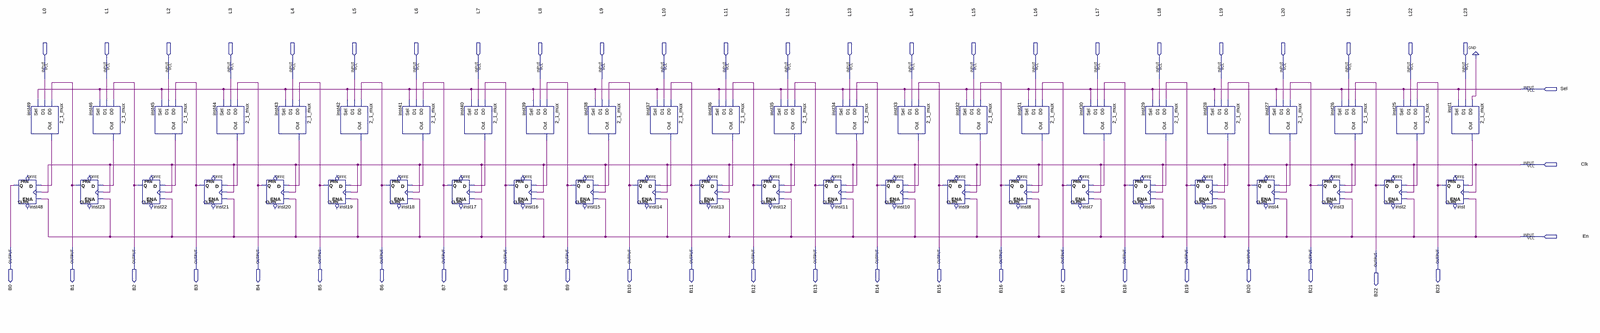
[diagram p0: schematic sheet, whole]
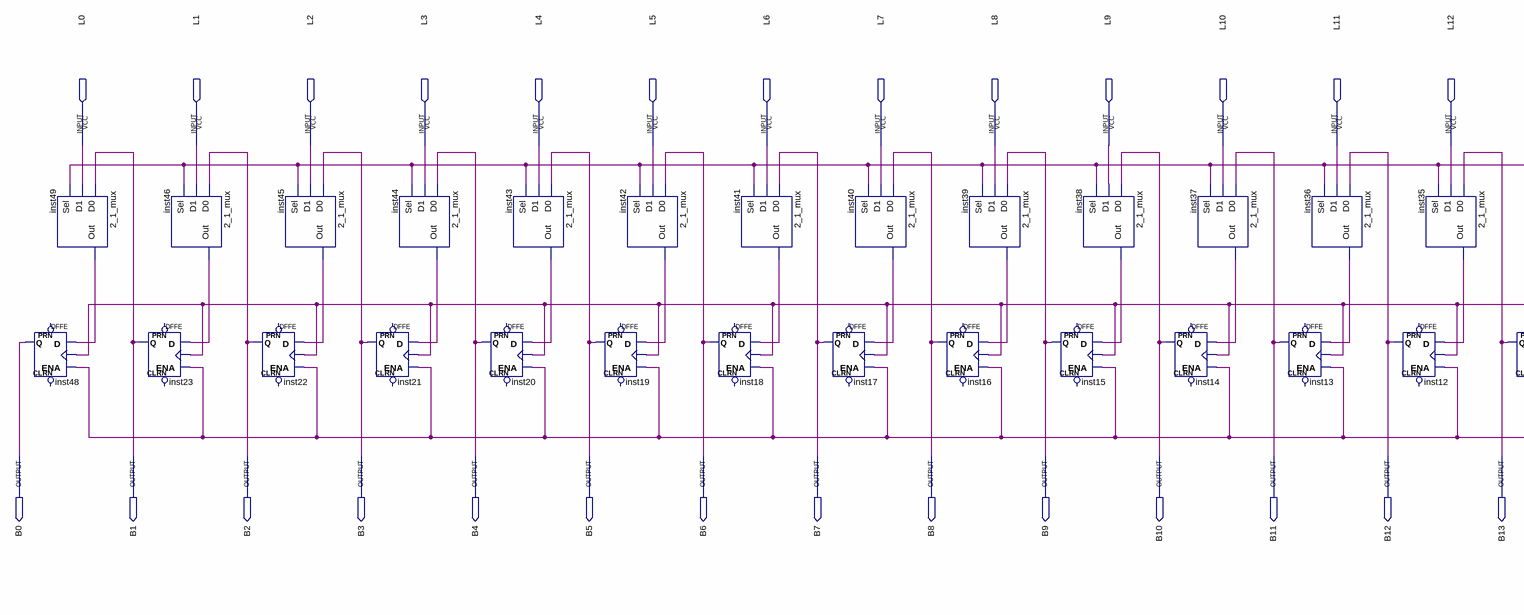
[diagram p1: schematic sheet, left part]
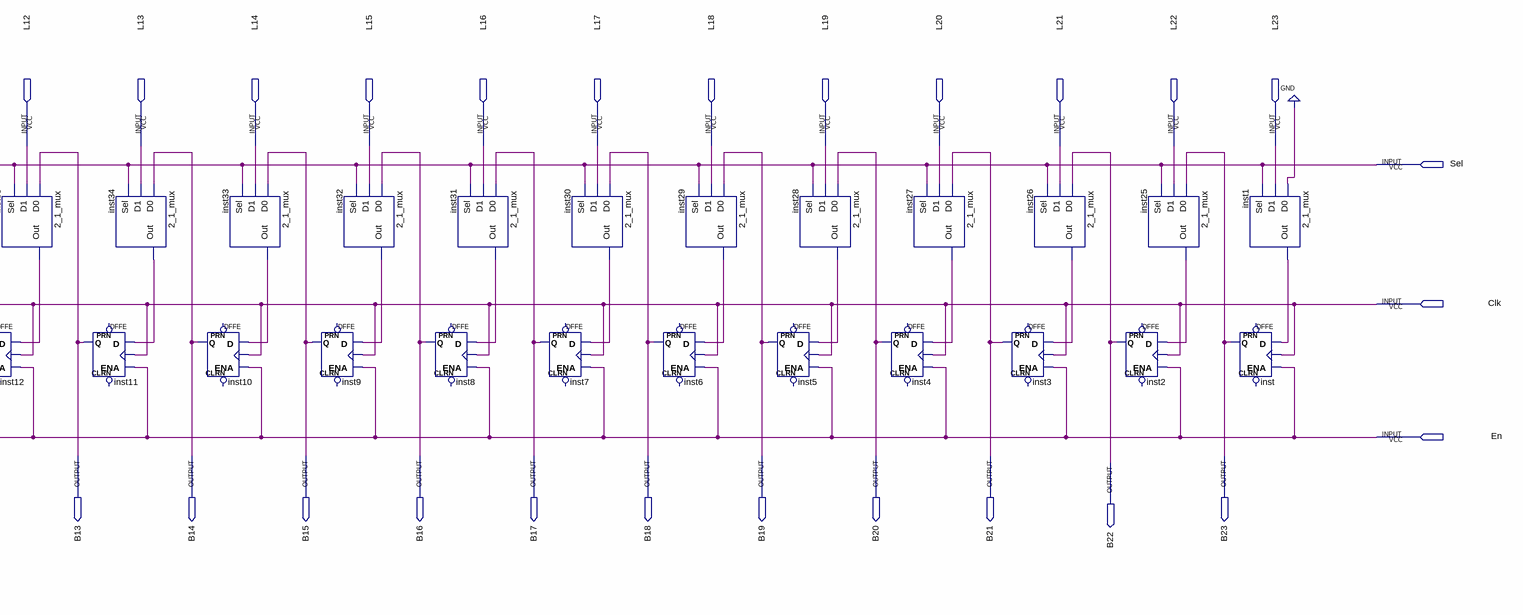
[diagram p2: schematic sheet, right part]
// Quartus schematic 24_bit_par_in_ser_par_out_reg.bdf as structural Verilog: 48 symbols, 51 pins
module \24_bit_par_in_ser_par_out_reg  (
  input  L0,
  input  L1,
  input  L2,
  input  L3,
  input  L4,
  input  L5,
  input  L6,
  input  L7,
  input  L8,
  input  L9,
  input  L10,
  input  L11,
  input  L12,
  input  L13,
  input  L14,
  input  L15,
  input  L16,
  input  L17,
  input  L18,
  input  L19,
  input  L20,
  input  L21,
  input  L22,
  input  L23,
  input  Sel,
  input  Clk,
  input  En,
  output B0,
  output B1,
  output B2,
  output B3,
  output B4,
  output B5,
  output B6,
  output B7,
  output B8,
  output B9,
  output B10,
  output B11,
  output B12,
  output B13,
  output B14,
  output B15,
  output B16,
  output B17,
  output B18,
  output B19,
  output B20,
  output B21,
  output B23,
  output B22
);

  wire inst1_out, inst25_out, inst26_out, inst27_out, inst28_out, inst29_out, inst30_out, inst31_out,
       inst32_out, inst33_out, inst34_out, inst35_out, inst36_out, inst37_out, inst38_out, inst39_out,
       inst40_out, inst41_out, inst42_out, inst43_out, inst44_out, inst45_out, inst46_out, inst49_out;

  DFFE inst48 (.D(inst49_out), .CLK(Clk), .ENA(En), .Q(B0));  // open: PRN, CLRN
  \2_1_mux  inst49 (.D0(B1), .D1(L0), .Sel(Sel), .Out(inst49_out));
  DFFE inst23 (.D(inst46_out), .CLK(Clk), .ENA(En), .Q(B1));  // open: PRN, CLRN
  \2_1_mux  inst46 (.D0(B2), .D1(L1), .Sel(Sel), .Out(inst46_out));
  \2_1_mux  inst45 (.D0(B3), .D1(L2), .Sel(Sel), .Out(inst45_out));
  DFFE inst22 (.D(inst45_out), .CLK(Clk), .ENA(En), .Q(B2));  // open: PRN, CLRN
  \2_1_mux  inst44 (.D0(B4), .D1(L3), .Sel(Sel), .Out(inst44_out));
  DFFE inst21 (.D(inst44_out), .CLK(Clk), .ENA(En), .Q(B3));  // open: PRN, CLRN
  DFFE inst20 (.D(inst43_out), .CLK(Clk), .ENA(En), .Q(B4));  // open: PRN, CLRN
  \2_1_mux  inst43 (.D0(B5), .D1(L4), .Sel(Sel), .Out(inst43_out));
  DFFE inst19 (.D(inst42_out), .CLK(Clk), .ENA(En), .Q(B5));  // open: PRN, CLRN
  \2_1_mux  inst42 (.D0(B6), .D1(L5), .Sel(Sel), .Out(inst42_out));
  \2_1_mux  inst41 (.D0(B7), .D1(L6), .Sel(Sel), .Out(inst41_out));
  DFFE inst18 (.D(inst41_out), .CLK(Clk), .ENA(En), .Q(B6));  // open: PRN, CLRN
  \2_1_mux  inst40 (.D0(B8), .D1(L7), .Sel(Sel), .Out(inst40_out));
  DFFE inst17 (.D(inst40_out), .CLK(Clk), .ENA(En), .Q(B7));  // open: PRN, CLRN
  DFFE inst16 (.D(inst39_out), .CLK(Clk), .ENA(En), .Q(B8));  // open: PRN, CLRN
  \2_1_mux  inst39 (.D0(B9), .D1(L8), .Sel(Sel), .Out(inst39_out));
  DFFE inst15 (.D(inst38_out), .CLK(Clk), .ENA(En), .Q(B9));  // open: PRN, CLRN
  \2_1_mux  inst38 (.D0(B10), .D1(L9), .Sel(Sel), .Out(inst38_out));
  \2_1_mux  inst37 (.D0(B11), .D1(L10), .Sel(Sel), .Out(inst37_out));
  DFFE inst14 (.D(inst37_out), .CLK(Clk), .ENA(En), .Q(B10));  // open: PRN, CLRN
  \2_1_mux  inst36 (.D0(B12), .D1(L11), .Sel(Sel), .Out(inst36_out));
  DFFE inst13 (.D(inst36_out), .CLK(Clk), .ENA(En), .Q(B11));  // open: PRN, CLRN
  DFFE inst12 (.D(inst35_out), .CLK(Clk), .ENA(En), .Q(B12));  // open: PRN, CLRN
  \2_1_mux  inst35 (.D0(B13), .D1(L12), .Sel(Sel), .Out(inst35_out));
  DFFE inst11 (.D(inst34_out), .CLK(Clk), .ENA(En), .Q(B13));  // open: PRN, CLRN
  \2_1_mux  inst34 (.D0(B14), .D1(L13), .Sel(Sel), .Out(inst34_out));
  \2_1_mux  inst33 (.D0(B15), .D1(L14), .Sel(Sel), .Out(inst33_out));
  DFFE inst10 (.D(inst33_out), .CLK(Clk), .ENA(En), .Q(B14));  // open: PRN, CLRN
  \2_1_mux  inst32 (.D0(B16), .D1(L15), .Sel(Sel), .Out(inst32_out));
  DFFE inst9 (.D(inst32_out), .CLK(Clk), .ENA(En), .Q(B15));  // open: PRN, CLRN
  DFFE inst8 (.D(inst31_out), .CLK(Clk), .ENA(En), .Q(B16));  // open: PRN, CLRN
  \2_1_mux  inst31 (.D0(B17), .D1(L16), .Sel(Sel), .Out(inst31_out));
  DFFE inst7 (.D(inst30_out), .CLK(Clk), .ENA(En), .Q(B17));  // open: PRN, CLRN
  \2_1_mux  inst30 (.D0(B18), .D1(L17), .Sel(Sel), .Out(inst30_out));
  \2_1_mux  inst29 (.D0(B19), .D1(L18), .Sel(Sel), .Out(inst29_out));
  DFFE inst6 (.D(inst29_out), .CLK(Clk), .ENA(En), .Q(B18));  // open: PRN, CLRN
  \2_1_mux  inst28 (.D0(B20), .D1(L19), .Sel(Sel), .Out(inst28_out));
  DFFE inst5 (.D(inst28_out), .CLK(Clk), .ENA(En), .Q(B19));  // open: PRN, CLRN
  DFFE inst4 (.D(inst27_out), .CLK(Clk), .ENA(En), .Q(B20));  // open: PRN, CLRN
  \2_1_mux  inst27 (.D0(B21), .D1(L20), .Sel(Sel), .Out(inst27_out));
  \2_1_mux  inst26 (.D0(B22), .D1(L21), .Sel(Sel), .Out(inst26_out));
  DFFE inst3 (.D(inst26_out), .CLK(Clk), .ENA(En), .Q(B21));  // open: PRN, CLRN
  \2_1_mux  inst25 (.D0(B23), .D1(L22), .Sel(Sel), .Out(inst25_out));
  DFFE inst2 (.D(inst25_out), .CLK(Clk), .ENA(En), .Q(B22));  // open: PRN, CLRN
  \2_1_mux  inst1 (.D0(1'b0), .D1(L23), .Sel(Sel), .Out(inst1_out));
  DFFE inst (.D(inst1_out), .CLK(Clk), .ENA(En), .Q(B23));  // open: PRN, CLRN
endmodule
